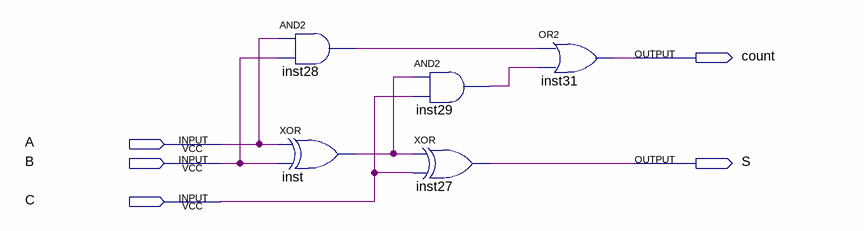
[diagram p0: schematic sheet]
// Quartus schematic fulladd.bdf as structural Verilog: 5 symbols, 5 pins
module fulladd (
  input  A,
  input  B,
  input  C,
  output count,
  output S
);

  wire inst28_out, inst29_out, inst_out;

  and inst28 (inst28_out, A, B);
  xor inst (inst_out, A, B);
  and inst29 (inst29_out, inst_out, C);
  xor inst27 (S, inst_out, C);
  or inst31 (count, inst28_out, inst29_out);
endmodule
